# EAGLE design tritiled22_cr2477 (EAGLE 8.2.2)
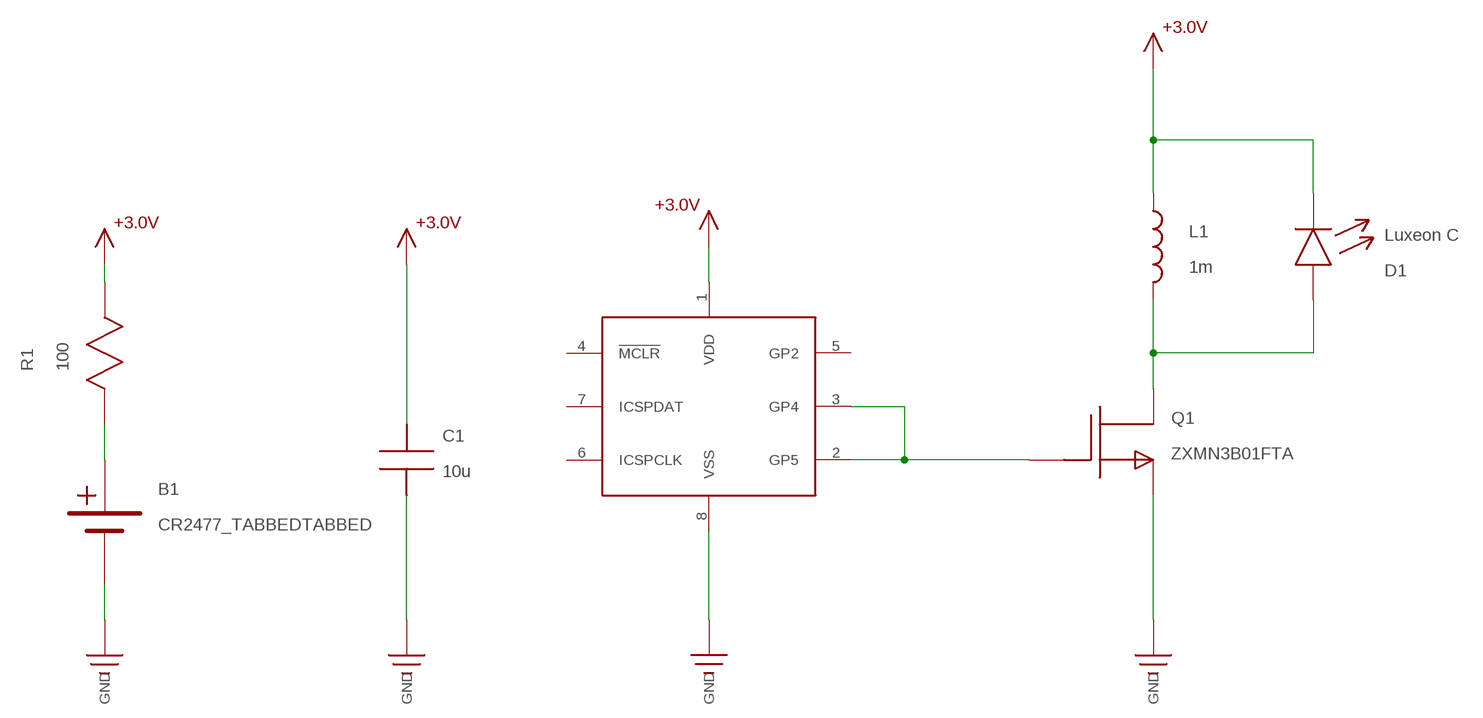
[diagram p0: schematic, sheet 1]

## Parts
B1  CR2477_TABBEDTABBED  [CR2477_TABBED]
C1  10u  C1206  [1206]
D1  Luxeon C  LEDLUXEON_C  [LUXEON_C]
L1  1m  SRR6028_INDUCTOR  [SRR6028_INDUCTOR]
Q1  ZXMN3B01FTA  ZXMN3B01FSOT23  [SOT-23]
R1  100  R1206  [R1206]
U1  PIC12LF1571  [SOIC8]

## Nets
+3.3V: C1.P$1 D1.C L1.P$1 R1.P$2 U1.1(VDD) ; supply symbol labelled +3.0V
GND: B1.GND(0V) C1.P$2 Q1.2(S) U1.8(VSS)
N$5: D1.A L1.P$2 Q1.3(D)
N$8: Q1.1(G) U1.2(GP5) U1.3(GP4)
VBATT: B1.+3V(+V) R1.P$1
Unconnected: U1.4(!MCLR!) U1.5(GP2) U1.6(ICSPCLK) U1.7(ICSPDAT)

## Library data of the parts
B1 = tritiled:CR2477_TABBED
C1 = tritiled:C
D1 = tritiled:LED
L1 = tritiled:SRR6028_INDUCTOR
Q1 = tritiled:ZXMN3B01F
R1 = tritiled:R
U1 = tritiled:PIC12LF1571

## Board
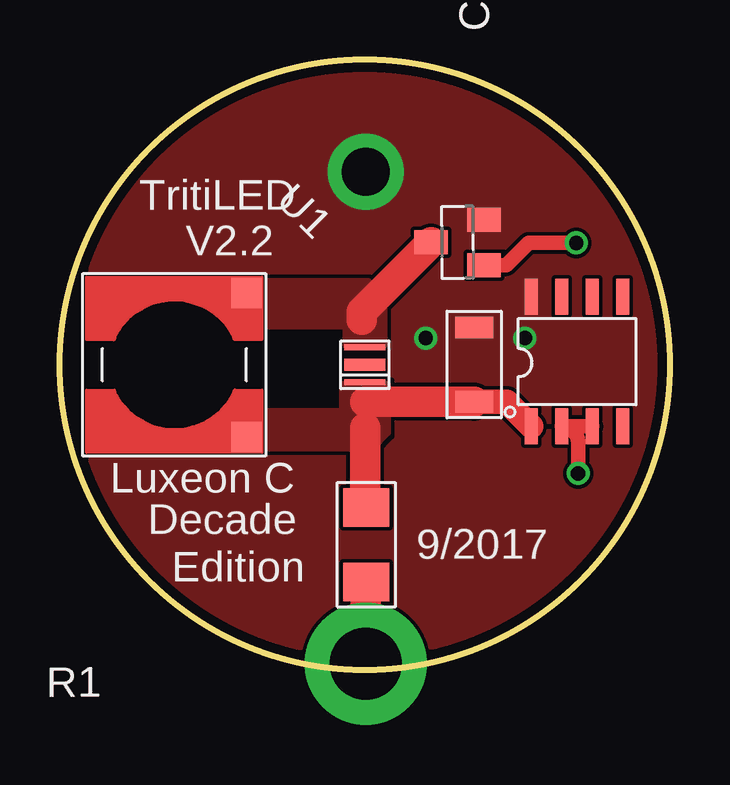
[diagram p1: board, top side]
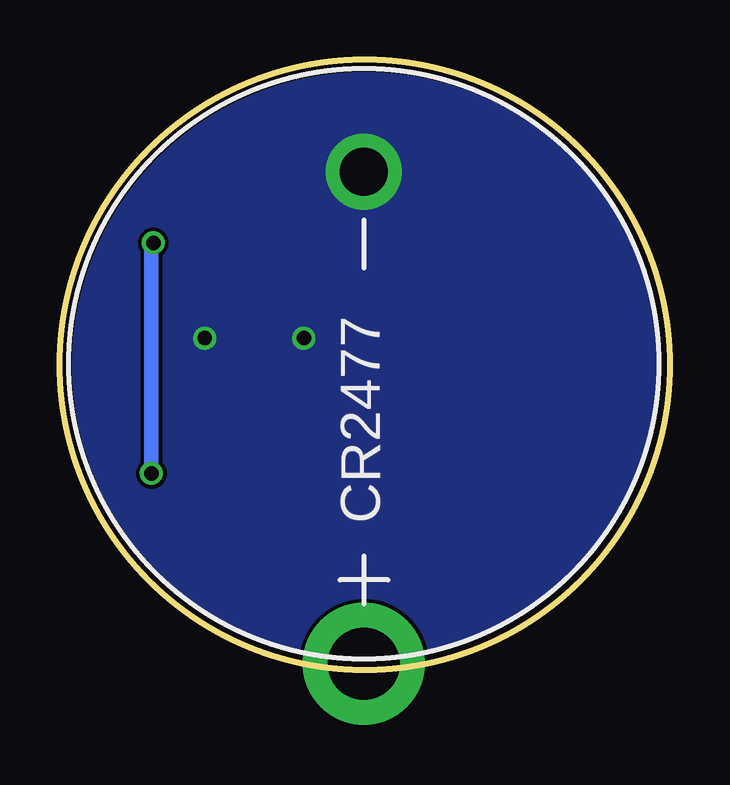
[diagram p2: board, bottom side, seen from below]

Size 25.4 x 25.4 mm. Coordinates in mm from the lower left corner, seen from the top.
Outline: circle at 12.7,12.7 radius 12.7
Copper layers (1*16): Top 0.0356mm / dielectric 1.5011mm / Bottom 0.0356mm
Design rules "LaenPCBOrder_tented_vias": minimum track width 6mil, minimum drill 13mil, track to track 6mil, track to pad 6mil, pad to pad 6mil, via to via 6mil, smd to smd 6mil, copper to edge 15mil, drill to drill 6mil, minimum pad ring 7mil, minimum via ring 7mil, stop-mask expansion 3mil, vias tented up to drill 16mil, thermal gap 10mil

### Footprints (pad centres in the part's own frame; a part is rotated, then mirrored left to right if it is on the bottom)
CR2477_TABBED = drill 3 pad 5.08: +3V 12.5,0 | drill 2 pad 3.175: GND -8,0
1206 = smd 0.9 x 1.6: P$1 -1.55,0; P$2 1.55,0
LUXEON_C = smd 0.25 x 1.7: A -0.725,0; C 0.725,0 | smd 0.5 x 1.7: HS 0,0
SRR6028_INDUCTOR = smd 1.27 x 1.27: P$1 -3,3; P$2 -3,-3
SOT-23 = smd 1 x 1.4: 1 -0.95,-1.1; 2 0.95,-1.1; 3 0,1.1
R1206 = smd 1.6 x 1.9: P$1 -1.55,0; P$2 1.55,0
SOIC8 = smd 0.55 x 1.5: 1 -1.905,-2.7; 2 -0.635,-2.7; 3 0.635,-2.7; 4 1.905,-2.7; 5 1.905,2.7; 6 0.635,2.7; 7 -0.635,2.7; 8 -1.905,2.7

### Placement (x,y rotation side)
B1  12.74,12.74 270 bottom
C1  17.26,12.71 90 top
D1  12.7,12.7 270 top
L1  4.76,12.7 180 top
Q1  16.56,17.8 90 top
R1  12.76,5.2 90 top
U1  21.55,12.83 0 top

### Tracks (layer width: path | path; a pad name or v marks a point on that pad's centre or on a via)
+3.3V
  Top 1.016: U1.1 18.61,11.16 C1.P$1
  Top 1.27: R1.P$2 12.72,6.79 12.72,10.07 | C1.P$1 12.72,11.16
  pour Top (no thermals): 11.76,11.91 13.67,11.91 13.67,9.85 13.02,9.21 7.3,9.21 7.3,10.79 11.75,10.79 11.76,10.8
GND  (via drill 0.6)
  other vias: 15.24,13.81 19.37,13.81
  pour Bottom (no thermals): -1.91,-1.91 27.94,-1.91 27.94,27.3 -1.91,27.3
  pour Top (rank 2, no thermals): -1.91,-1.91 27.94,-1.91 27.94,27.3 -1.91,27.3
N$5
  Top 1.27: Q1.3 12.56,14.9 12.56,14.59
  pour Top (no thermals): 7.3,16.19 12.86,16.19 13.51,15.54 13.51,13.49 11.92,13.49 11.92,14.29 7.3,14.29
N$8  (via drill 0.6)
  Top 0.61: U1.3 U1.2 arc-90 21.59,9.45 v21.59,8.18 | Q1.1 18.59,16.85 19.53,17.78 v21.51,17.78
  Bottom 0.61: v21.51,17.78 21.59,17.78 v21.59,8.18 | v21.59,8.18 21.59,8.1 v21.59,8.18
VBATT
  Top 1.27: R1.P$1 12.74,3.63 B1.+3V

### Text on the board
tPlace: TritiLED | V2.2 | Luxeon C | Decade | 9/2017 | Edition